# EAGLE design usb (EAGLE 4.13)
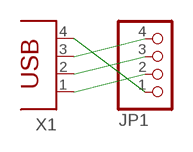
[diagram p0: schematic, sheet 1]

## Parts
JP1  PINHD-1X4  [1X04]
X1  PN61729  [PN61729]

## Nets
N$1: JP1.4 X1.3
N$2: JP1.3 X1.2
N$3: JP1.2 X1.1
N$4: JP1.1 X1.4

## Library data of the parts
JP1 = pinhead:PINHD-1X4: PIN HEADER
X1 = con-berg:PN61729: BERG USB connector

## Board
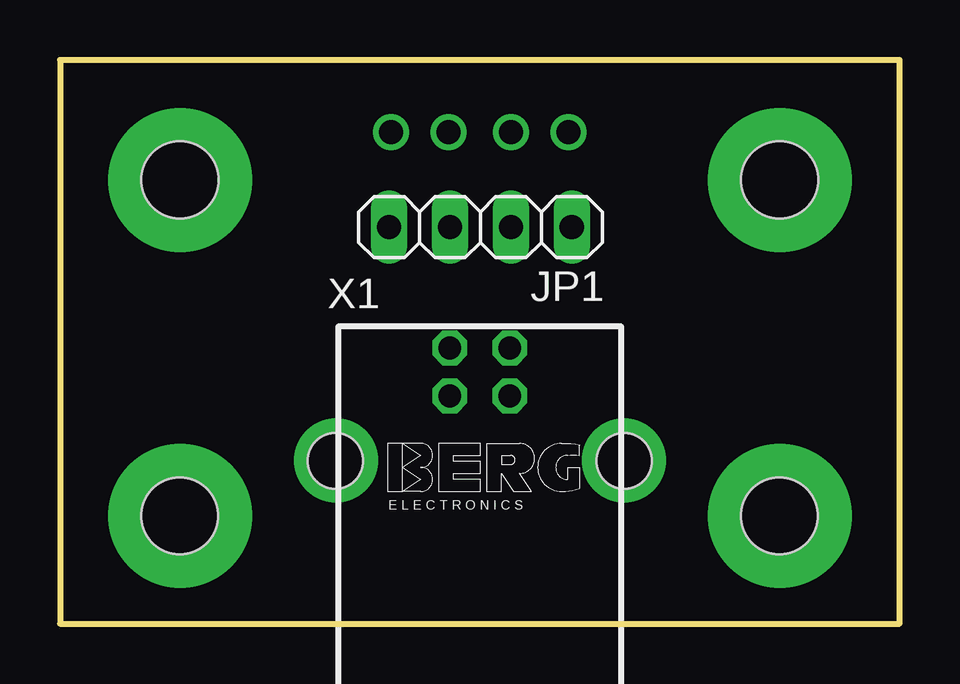
[diagram p1: board, top side]
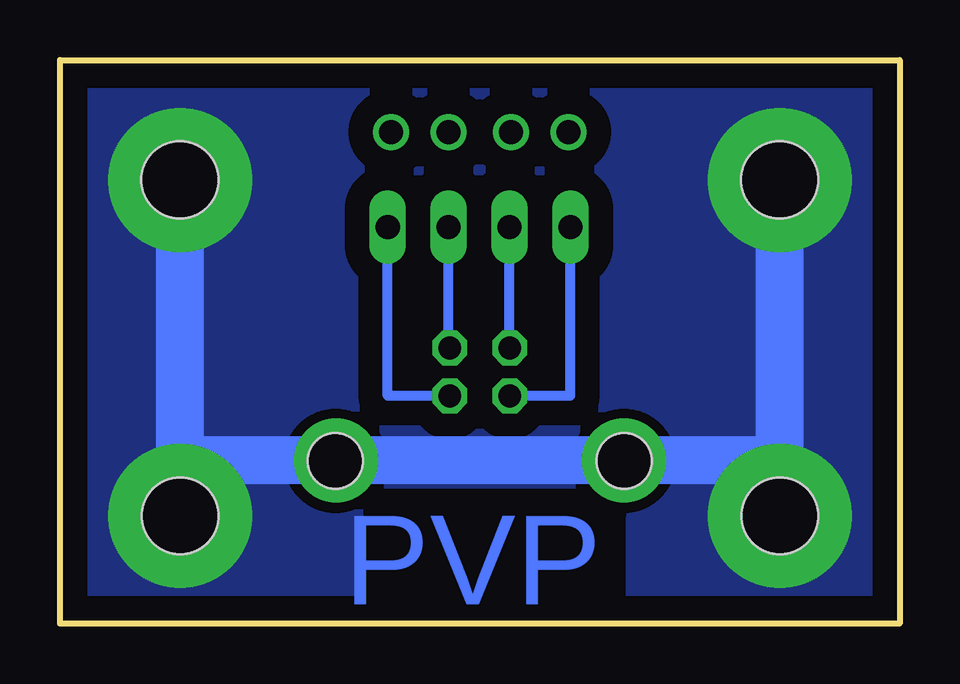
[diagram p2: board, bottom side, seen from below]

Size 35 x 23.5 mm. Coordinates in mm from the lower left corner, seen from the top.
Outline: 0,0 35,0 35,23.5 0,23.5 0,0
Copper layers (1*16): Top 0.035mm / dielectric 1.5mm / Bottom 0.035mm
Design rules "default": minimum track width 10mil, minimum drill 24mil, track to track 8mil, track to pad 8mil, pad to pad 8mil, via to via 8mil, smd to smd 8mil, copper to edge 40mil, drill to drill 8mil, minimum pad ring 10mil, minimum via ring 8mil, stop-mask expansion 4mil, vias tented up to drill 0mil, thermal gap 10mil
Holes 3.2 mm at 29.99,4.49 4.99,4.49 5,18.5 30,18.5

### Footprints (pad centres in the part's own frame; a part is rotated, then mirrored left to right if it is on the bottom)
1X04 = drill 1.016 long: 1 -3.81,0; 2 -1.27,0; 3 1.27,0; 4 3.81,0
PN61729 = drill 0.95 octagon: 1 1.25,4.71; 2 -1.25,4.71; 3 -1.25,2.71; 4 1.25,2.71 | hole 2.3: -6.02,0; 6.02,0

### Placement (x,y rotation side)
JP1  17.53,16.53 180 top
X1  17.5,6.78 0 top

### Tracks (layer width: path | path; a pad name or v marks a point on that pad's centre or on a via)
GND  (via drill 2.2 pad 3.5, 3.2 pad 6)
  Bottom 1.016: 23.6,6.8 v23.5,6.8
  Bottom 2: v5,4.5 5,6.8 | 5,6.8 v5,18.5 | 30,6.8 v30,4.5 | 30,6.8 v30,18.5 | 5,6.8 v11.5,6.8 22.6,6.8 23.6,6.8 30,6.8
  pour Bottom (isolate 1.016): -0.4,23.8 35.6,23.8 35.6,-0.2 -0.4,-0.2
N$1
  Bottom 0.406: X1.3 16.3,9.5 | X1.3 | JP1.4 13.72,9.5 X1.3
N$2
  Bottom 0.406: X1.2 16.2,11.5 | X1.2 | JP1.3 X1.2
N$3
  Bottom 0.406: X1.1 18.75,11.4 18.8,11.4 JP1.2
N$4
  Bottom 0.406: X1.4 18.7,9.5 | X1.4 | JP1.1 21.34,9.5 X1.4
S$4  (via drill 1)
  other vias: 16.2,20.5
S$5  (via drill 1)
  other vias: 18.8,20.5
S$6  (via drill 1)
  other vias: 13.8,20.5
S$7  (via drill 1)
  other vias: 21.2,20.5

### Text on the board
Bottom: PVP